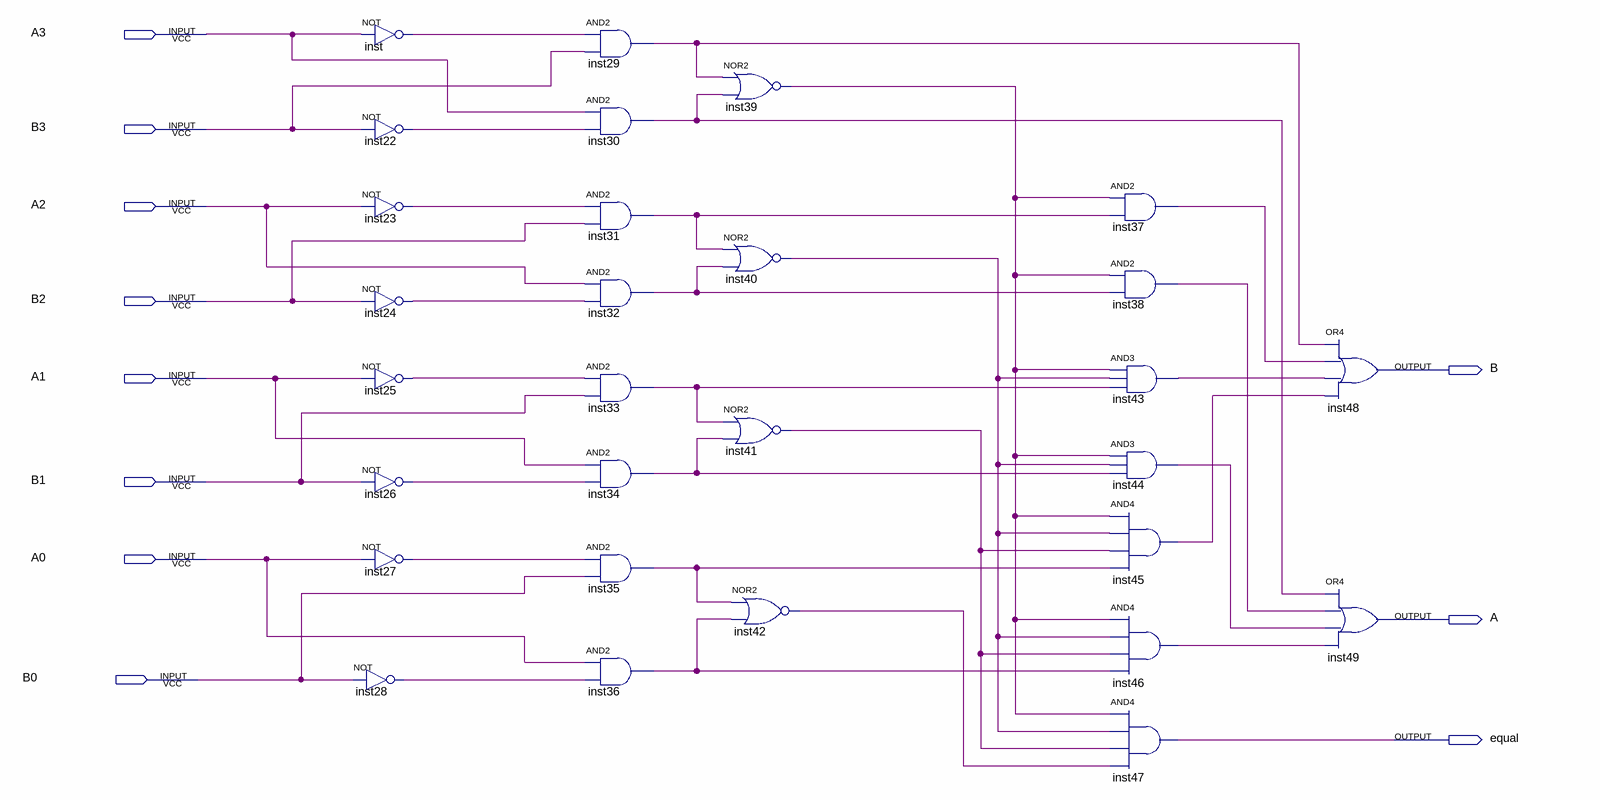
[diagram p0: schematic sheet]
// Quartus schematic 4BitMagnitudeComparatorSche.bdf as structural Verilog: 29 symbols, 11 pins
module \4BitMagnitudeComparatorSche  (
  input  A3,
  input  B3,
  input  A2,
  input  B2,
  input  A1,
  input  B1,
  input  A0,
  input  B0,
  output B,
  output A,
  output equal
);

  wire inst22_out, inst23_out, inst24_out, inst25_out, inst26_out, inst27_out, inst28_out, inst29_out,
       inst30_out, inst31_out, inst32_out, inst33_out, inst34_out, inst35_out, inst36_out, inst37_out,
       inst38_out, inst39_out, inst40_out, inst41_out, inst42_out, inst43_out, inst44_out, inst45_out,
       inst46_out, inst_out;

  not inst (inst_out, A3);
  not inst22 (inst22_out, B3);
  not inst23 (inst23_out, A2);
  not inst24 (inst24_out, B2);
  not inst25 (inst25_out, A1);
  not inst26 (inst26_out, B1);
  not inst27 (inst27_out, A0);
  not inst28 (inst28_out, B0);
  and inst29 (inst29_out, inst_out, B3);
  and inst30 (inst30_out, A3, inst22_out);
  and inst31 (inst31_out, inst23_out, B2);
  and inst32 (inst32_out, A2, inst24_out);
  and inst33 (inst33_out, inst25_out, B1);
  and inst34 (inst34_out, A1, inst26_out);
  and inst35 (inst35_out, inst27_out, B0);
  and inst36 (inst36_out, A0, inst28_out);
  nor inst39 (inst39_out, inst29_out, inst30_out);
  nor inst40 (inst40_out, inst31_out, inst32_out);
  nor inst41 (inst41_out, inst33_out, inst34_out);
  nor inst42 (inst42_out, inst35_out, inst36_out);
  and inst37 (inst37_out, inst39_out, inst31_out);
  and inst38 (inst38_out, inst39_out, inst32_out);
  and inst43 (inst43_out, inst39_out, inst40_out, inst33_out);
  and inst44 (inst44_out, inst39_out, inst40_out, inst34_out);
  and inst45 (inst45_out, inst39_out, inst40_out, inst41_out, inst35_out);
  and inst46 (inst46_out, inst39_out, inst40_out, inst41_out, inst36_out);
  and inst47 (equal, inst39_out, inst40_out, inst41_out, inst42_out);
  or inst48 (B, inst29_out, inst37_out, inst43_out, inst45_out);
  or inst49 (A, inst30_out, inst38_out, inst44_out, inst46_out);
endmodule
